# EAGLE design Power_Board (EAGLE 7.2.0)
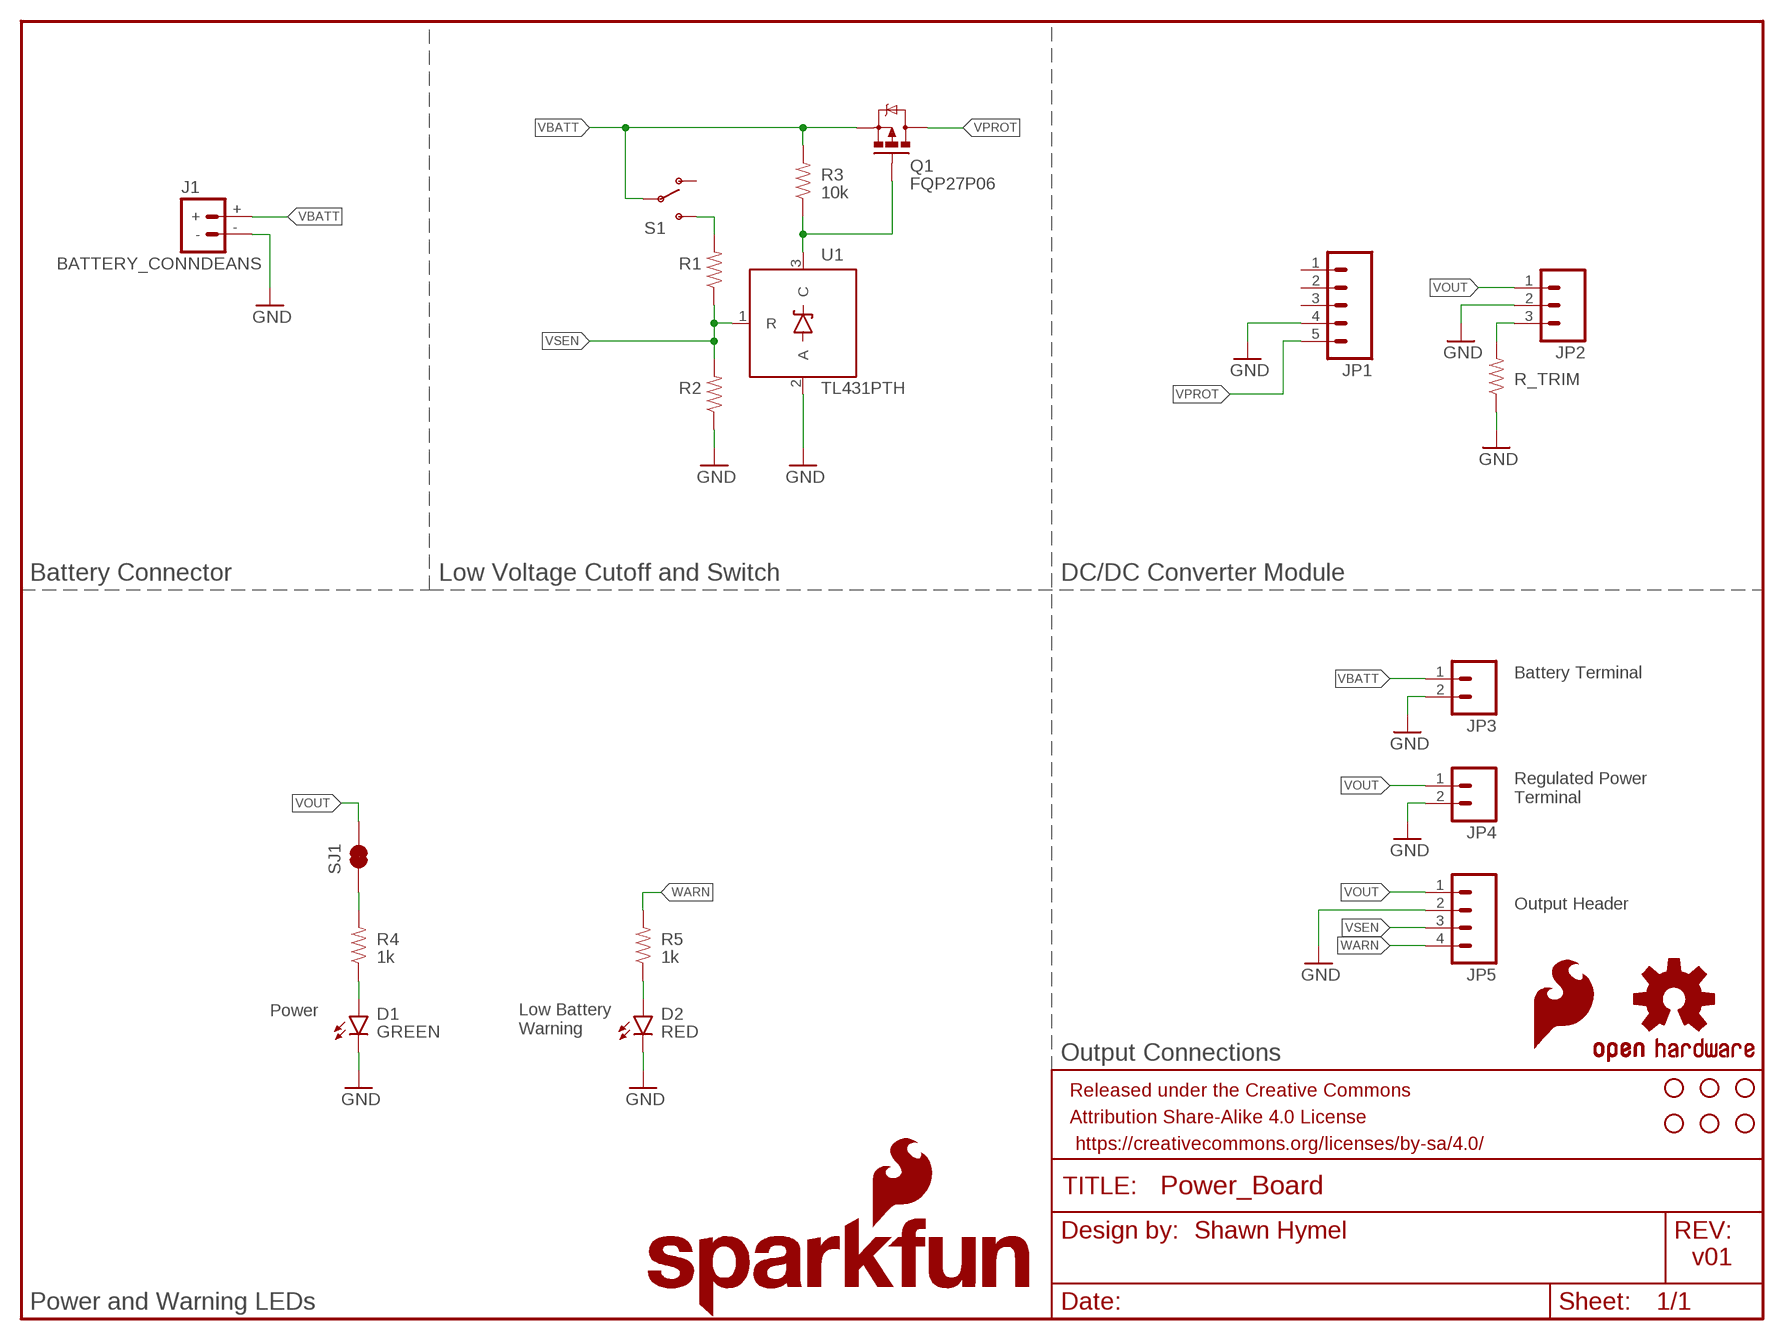
[diagram p0: schematic, sheet 1]

## Parts
D1  GREEN  LED5MM  [LED5MM]
D2  RED  LED5MM  [LED5MM]
FRAME1  FRAME-LETTER  [CREATIVE_COMMONS]
J1  BATTERY_CONNDEANS  [DEANS]
JP1  M05LOCK  [1X05_LOCK]
JP2  M03LOCK  [1X03_LOCK]
JP3  M025MM  [SCREWTERMINAL-5MM-2]
JP4  M025MM  [SCREWTERMINAL-5MM-2]
JP5  M04LOCK  [1X04_LOCK]
LOGO1  OSHW-LOGOS  [OSHW-LOGO-S]
LOGO2  SFE_LOGO_FLAME.1_INCH  [SFE_LOGO_FLAME_.1]
LOGO3  SFE_LOGO_NAME_FLAME.2_INCH  [SFE_LOGO_NAME_FLAME_.2]
Q1  MOSFET-PCHANNELFQP27P06  [TO220V]
R1  RESISTORPTH-1/4W  [AXIAL-0.4]
R2  RESISTORPTH-1/4W  [AXIAL-0.4]
R3  RESISTORPTH-1/4W  [AXIAL-0.4]
R4  RESISTORPTH-1/4W  [AXIAL-0.4]
R5  RESISTORPTH-1/4W  [AXIAL-0.4]
R_TRIM  RESISTORPTH-1/4W  [AXIAL-0.4]
S1  SWITCH-SPDTPTH  [SWITCH-SPDT]
SJ1  JUMPER-PAD-2-NC_BY_TRACE  [PAD-JUMPER-2-NC_BY_TRACE_YES_SILK]
STANDOFF1  STAND-OFF  [STAND-OFF]
STANDOFF2  STAND-OFF  [STAND-OFF]
STANDOFF3  STAND-OFF  [STAND-OFF]
STANDOFF4  STAND-OFF  [STAND-OFF]
STANDOFF5  STAND-OFF  [STAND-OFF]
STANDOFF6  STAND-OFF  [STAND-OFF]
U1  TL431PTH  [TO-92]

## Nets
GND: D1.K(C) D2.K(C) J1.- JP1.4 JP2.2 JP3.2 JP4.2 JP5.2 R2.P$1 R_TRIM.P$1 U1.2(A)
N$1: JP2.3 R_TRIM.P$2
N$2: R1.P$2 S1.3(S)
N$3: D1.A R4.P$1
N$4: D2.A R5.P$1
N$5: R4.P$2 SJ1.1
N$6: Q1.1(G) R3.P$1 U1.3(C)
VBATT: J1.+ JP3.1 Q1.3(S) R3.P$2 S1.2(P)
VOUT: JP2.1 JP4.1 JP5.1 SJ1.2
VPROT: JP1.5 Q1.2(D)
VSEN: JP5.3 R1.P$1 R2.P$2 U1.1(R)
WARN: JP5.4 R5.P$2
Unconnected: JP1.1 JP1.2 JP1.3 S1.1(O)

## Notes on the sheet
- 10k
- Battery Connector | Low Voltage Cutoff and Switch | DC/DC Converter Module
- Battery Terminal
- Regulated Power
  Terminal
- Output Header
- 1k | 1k
- Power
- Low Battery
  Warning
- Output Connections
- Power and Warning LEDs

## Library data of the parts
D1 D2 = SparkFun-LED:LED: LEDs Standard schematic elements and footprints for 5mm, 3mm, 1206, and 0603 sized LEDs. 5mm - Spark Fun Electronics SKU : COM-00529 (and others)
FRAME1 = SparkFun-Aesthetics:FRAME-LETTER: Schematic Frame Standard 8.5x11 US Letter frame; DESIGNER: Shawn Hymel; VERSION: v01
J1 = SparkFun-Connectors:BATTERY_CONN: Various footprints for battery connectors
JP1 = SparkFun-Connectors:M05: Header 5 Standard 5-pin 0.1" header. Use with straight break away headers (SKU : PRT-00116), right angle break away headers (PRT-00553), swiss pins (PRT-00743), machine pins (PRT-00117), and female headers (PRT-00115). Molex polarized connector foot print use with SKU : PRT-08230 with associated crimp pins and housings.
JP2 = SparkFun-Connectors:M03: Header 3 Standard 3-pin 0.1" header. Use with straight break away headers (SKU : PRT-00116), right angle break away headers (PRT-00553), swiss pins (PRT-00743), machine pins (PRT-00117), and female headers (PRT-00115). Molex polarized connector foot print use with SKU : PRT-08232 with associated crimp pins and housings.
JP3 JP4 = SparkFun-Connectors:M02: Standard 2-pin 0.1" header. Use with - straight break away headers ( PRT-00116) - right angle break away headers (PRT-00553) - swiss pins (PRT-00743) - machine pins (PRT-00117) - female headers (PRT-00115) Molex polarized connector foot print use with: PRT-08233 with associated crimp pins and housings. 2.54_SCREWTERM for use with PRT-10571. 3.5mm Screw Terminal footprints for PRT-08084 5mm Screw Terminal footprints for use with PRT-08432; STOREFRONT_ID: PRT-08432
JP5 = SparkFun-Connectors:M04: Header 4 Standard 4-pin 0.1" header. Use with straight break away headers (SKU : PRT-00116), right angle break away headers (PRT-00553), swiss pins (PRT-00743), machine pins (PRT-00117), and female headers (PRT-00115). Molex polarized connector foot print use with SKU : PRT-08231 with associated crimp pins and housings. 1MM SMD Version SKU: PRT-10208
LOGO1 = SparkFun-Aesthetics:OSHW-LOGO: Open Source Hardware Logo This logo indicates the piece of hardware it is found on incorporates a OSHW license and/or adheres to the definition of open source hardware found here: http://freedomdefined.org/OSHW
LOGO2 = SparkFun-Aesthetics:SFE_LOGO_FLAME: SFE Logo, flame only This is the SparkFun flame logo. The logo on the schematic will always be the same size; the package variant is the height of the flame. Default layer for the logo on the board is tSilk.
LOGO3 = SparkFun-Aesthetics:SFE_LOGO_NAME_FLAME: SFE Logo, name and flame This is the SparkFun full logo. The logo on the schematic will always be the same size; the package variant is the height of the flame part of the logo. Default layer for the logo on the board is tSilk.
Q1 = SparkFun-DiscreteSemi:MOSFET-PCHANNEL: Generic PMOSFET IRLML2244 - TRANS-11153 (SOT-23 -20V -4.3A) (1.Gate 2.Source 3.Drain) FQP27P06 - COM-10349 <http://www.sparkfun.com/products/10349> (TO-220 -60V -27A) (1.Gate 2.Source 3.Drain); PART_NAME: FQP27P06
R1-R5 R_TRIM = SparkFun-Resistors:RESISTOR: Resistor Basic schematic elements and footprints for 0603, 1206, and PTH resistors.
S1 = SparkFun-Electromechanical:SWITCH-SPDT: SPDT Switch Simple slide switch, Spark Fun Electronics SKU : COM-00102 DPDT SMT slide switch, AYZ0202, SWCH-08179; PROD_ID: SWCH-08261
SJ1 = SparkFun-Passives:JUMPER-PAD-2-NC_BY_TRACE
STANDOFF1-STANDOFF6 = SparkFun-Electromechanical:STAND-OFF: #4 Stand Off This is the mechanical footprint for a #4 phillips button head screw. Use the keepout ring to avoid running the screw head into surrounding components. SKU : PRT-00447
U1 = SparkFun-AnalogIC:TL431: Precision Programmable Reference

## Board
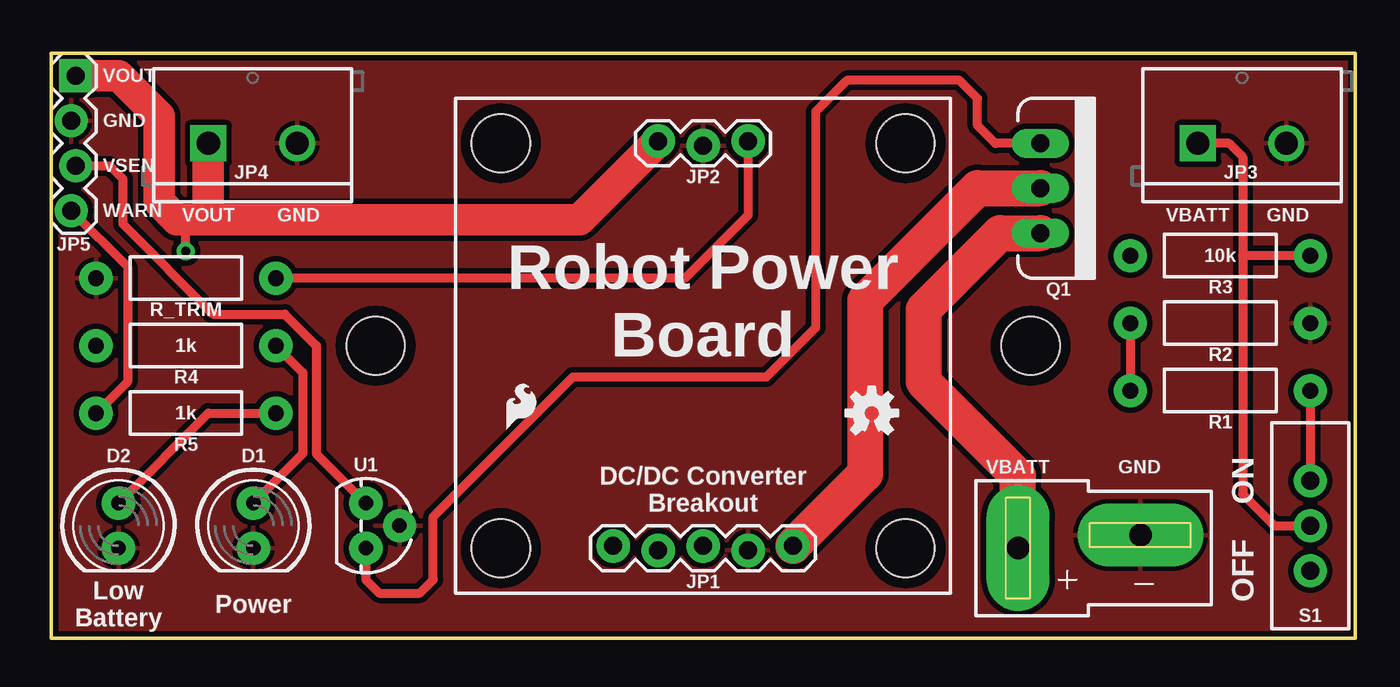
[diagram p1: board, top side]
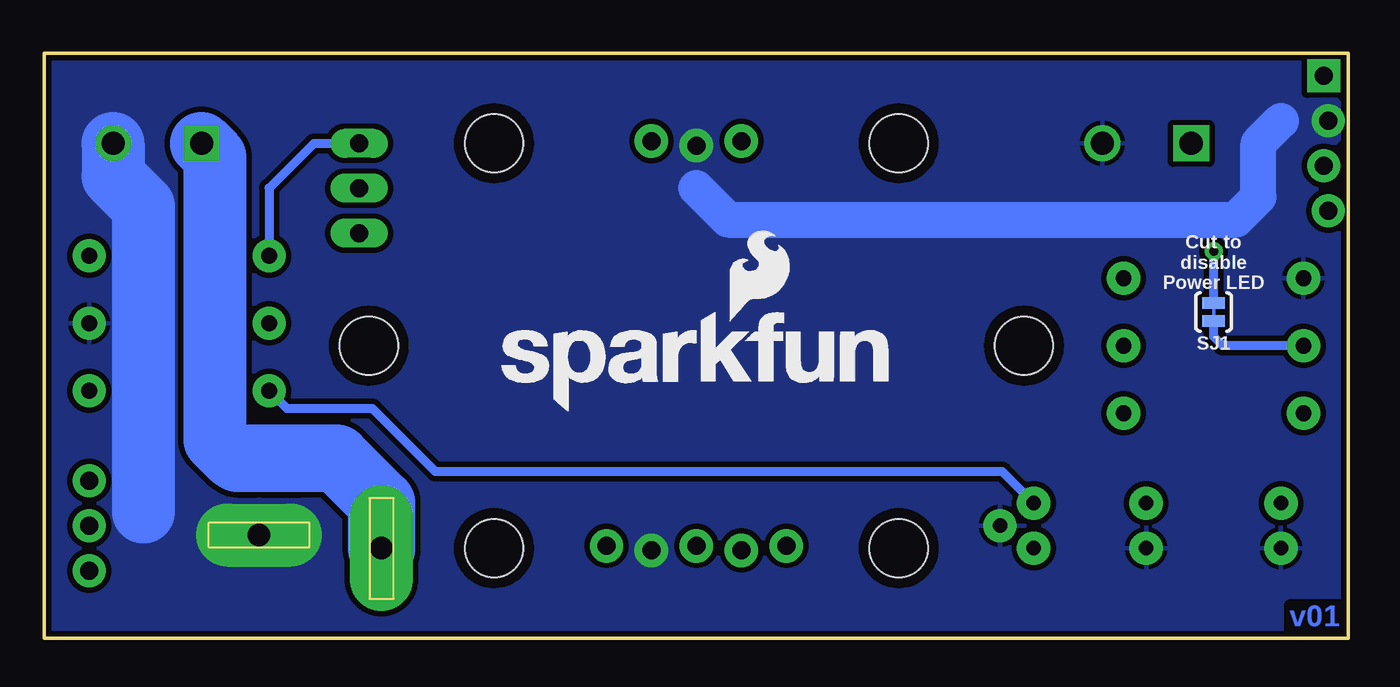
[diagram p2: board, bottom side, seen from below]

Size 73.66 x 33.02 mm. Coordinates in mm from the lower left corner, seen from the top.
Outline: 0,33.02 0,0 73.66,0 73.66,33.02 0,33.02
Copper layers (1*16): Top 0.035mm / dielectric 1.5mm / Bottom 0.035mm
Design rules "SparkFun-2-layer": minimum track width 7mil, minimum drill 15mil, track to track 8mil, track to pad 8mil, pad to pad 8mil, via to via 8mil, smd to smd 8mil, copper to edge 8mil, drill to drill 8mil, minimum pad ring 12mil, minimum via ring 10mil, stop-mask expansion 4mil, vias tented up to drill 20mil, thermal gap 10mil

### Footprints (pad centres in the part's own frame; a part is rotated, then mirrored left to right if it is on the bottom)
LED5MM = drill 0.813 pad 1.88: A -1.27,0; K 1.27,0
DEANS = drill 1.27 pad 3.556 long: + 0,0; - 0.737,-6.921
1X05_LOCK = drill 1.016 pad 1.88: 1 0,0.127; 2 2.54,-0.127; 3 5.08,0.127; 4 7.62,-0.127; 5 10.16,0.127
1X03_LOCK = drill 1.016 pad 1.88: 1 0,0.127; 2 2.54,-0.127; 3 5.08,0.127
SCREWTERMINAL-5MM-2 = drill 1.3 pad 2.032 square: 1 0,0 | drill 1.3 pad 2.032: 2 5,0
1X04_LOCK = drill 1.016 pad 1.88 square: 1 0,0.127 | drill 1.016 pad 1.88: 2 2.54,-0.127; 3 5.08,0.127; 4 7.62,-0.127
TO220V = drill 1.016 long: 1 -2.54,0; 2 0,0; 3 2.54,0
AXIAL-0.4 = drill 0.9 pad 1.88: P$1 -5.08,0; P$2 5.08,0
SWITCH-SPDT = drill 1.016 pad 1.88: 1 0,2.54; 2 0,0; 3 0,-2.54
PAD-JUMPER-2-NC_BY_TRACE_YES_SILK = smd 0.635 x 1.27: 1 -0.508,0; 2 0.508,0
STAND-OFF = hole 3.302: 0,0
TO-92 = drill 0.813 pad 1.88: 1 -1.27,0; 2 0,1.905; 3 1.27,0

### Placement (x,y rotation side)
D1  11.43,6.35 270 top
D2  3.81,6.35 270 top
FRAME1  -1.27,-10.16 0 top  (outside the outline)
J1  54.61,5.08 90 top
JP1  31.75,5.08 0 top
JP2  34.29,27.94 0 top
JP3  64.77,27.94 0 top
JP4  8.89,27.94 0 top
JP5  1.27,31.75 270 top
LOGO1  46.35,12.7 0 top
LOGO2  25.4,11.43 0 top
LOGO3  48.51,12.7 0 bottom
Q1  55.88,25.4 270 top
R1  66.04,13.97 0 top
R2  66.04,17.78 180 top
R3  66.04,21.59 0 top
R4  7.62,16.51 180 top
R5  7.62,12.7 180 top
R_TRIM  7.62,20.32 0 top
S1  71.12,6.35 180 top
SJ1  7.62,18.41 90 bottom
STANDOFF1  18.33,16.51 0 top
STANDOFF2  55.33,16.51 0 top
STANDOFF3  25.4,27.94 0 top
STANDOFF4  48.26,27.94 0 top
STANDOFF5  25.4,5.08 0 top
STANDOFF6  48.26,5.08 0 top
U1  17.78,6.35 270 top

### Tracks (layer width: path | path; a pad name or v marks a point on that pad's centre or on a via)
GND
  Bottom 2.032: 36.83,25.4 35.05,23.62 6.35,23.62 5.08,24.89 5.08,27.94 3.81,29.21
  Bottom 3.556: JP3.2 69.77,26.08 68.07,24.38 68.07,7.11
  pour Bottom (isolate 0.305): 0,33.02 73.66,33.02 73.66,0 0,0
  pour Bottom (isolate 0.305, no thermals): 58.93,3.81 57.66,5.08 57.66,6.6 58.93,7.87 69.6,7.87 69.6,3.81
  pour Bottom (isolate 0.305, no thermals): 0,29.72 0.76,30.48 4.06,30.48 4.06,27.94 0.76,27.94 0,28.7
  pour Bottom (isolate 0.305, no thermals): 35.56,25.4 35.56,29.21 38.1,29.21 38.1,25.65 37.85,25.4
  pour Bottom (isolate 0.305, no thermals): 38.1,3.56 38.1,7.62 40.64,7.62 40.64,3.56
  pour Top (isolate 0.305): 0,0 0,33.02 73.66,33.02 73.66,0
N$1
  Top 0.508: JP2.3 39.37,23.88 35.81,20.32 R_TRIM.P$2
N$2
  Top 0.508: R1.P$2 S1.3
N$3
  Top 0.508: R4.P$1 14.22,14.99 14.22,10.41 D1.A
N$4
  Top 0.508: D2.A 8.89,12.7 R5.P$1
N$5
  Bottom 0.508: R4.P$2 7.11,16.51 7.62,17.02 SJ1.1
N$6
  Top 0.508: U1.3 17.78,3.3 18.54,2.54 20.83,2.54 21.59,3.3 21.59,6.86 29.46,14.73 40.39,14.73 43.18,17.53 43.18,29.72 44.96,31.5 51.31,31.5 52.32,30.48 52.32,28.96 53.34,27.94 Q1.1
  Bottom 0.508: R3.P$1 60.96,25.4 58.42,27.94 Q1.1
VBATT
  Top 0.508: JP3.1 66.55,27.94 67.31,27.18 67.31,21.59 | 67.31,21.59 67.31,8.13 69.09,6.35 S1.2 | R3.P$2 67.31,21.59
  Top 2.032: J1.+ 54.61,9.14 49.28,14.48 49.28,18.54 53.59,22.86 Q1.3
  Bottom 0.508: 63.75,24.13 64.01,23.88
  Bottom 3.556: 62.74,10.16 62.99,10.16 64.01,11.18 64.01,23.88 64.01,27.18 JP3.1
  Bottom 3.81: J1.+ 54.61,7.62 57.15,10.16 62.74,10.16
VOUT  (via drill 0.51)
  Top 0.508: v7.62,21.84 7.62,23.62
  Top 1.778: JP5.1 3.81,31.75 6.1,29.46 6.1,24.64 7.11,23.62 7.62,23.62 8.89,23.62 | 8.89,23.62 29.84,23.62 JP2.1 | JP4.1 8.89,23.62
  Bottom 0.508: SJ1.2 v7.62,21.84
VPROT
  Top 2.032: JP1.5 45.97,9.27 45.97,19.05 52.32,25.4 Q1.2
VSEN
  Top 0.508: R2.P$2 R1.P$1 | JP5.3 3.3,26.67 4.06,25.91 4.06,23.37 9.14,18.29 13.21,18.29 14.99,16.51 14.99,10.41 U1.1
  Bottom 0.508: U1.1 19.56,9.4 51.56,9.4 55.12,12.95 59.94,12.95 R1.P$1
WARN
  Top 0.508: JP5.4 4.32,20.95 4.32,14.48 R5.P$2

### Text on the board
Bottom: v01
tPlace: VOUT | GND | VSEN | WARN | VOUT | GND | VBATT | GND | 10k | R_TRIM | Robot Power / Board | 1k | R2 | 1k | R1 | VBATT | GND | ON | DC/DC Converter / Breakout | OFF | Low / Battery | Power
bPlace: Cut to / disable / Power LED
tDocu: Shawn Hymel